# EasyEDA Pro project STM32 Minimum System.eprj

# Schematic Schematic1
Create Date: 2023-11-04; Page Name: P1; Project Name: STM32 Minimum System; Schematic Name: Schematic1; Update Date: 2023-11-03; Company: EasyEDA.com; Drawed: EasyEDA Pro; Page Size: A3; Part Number: JLCPCB-001; Reviewed: EasyEDA Pro; Version: V0.1
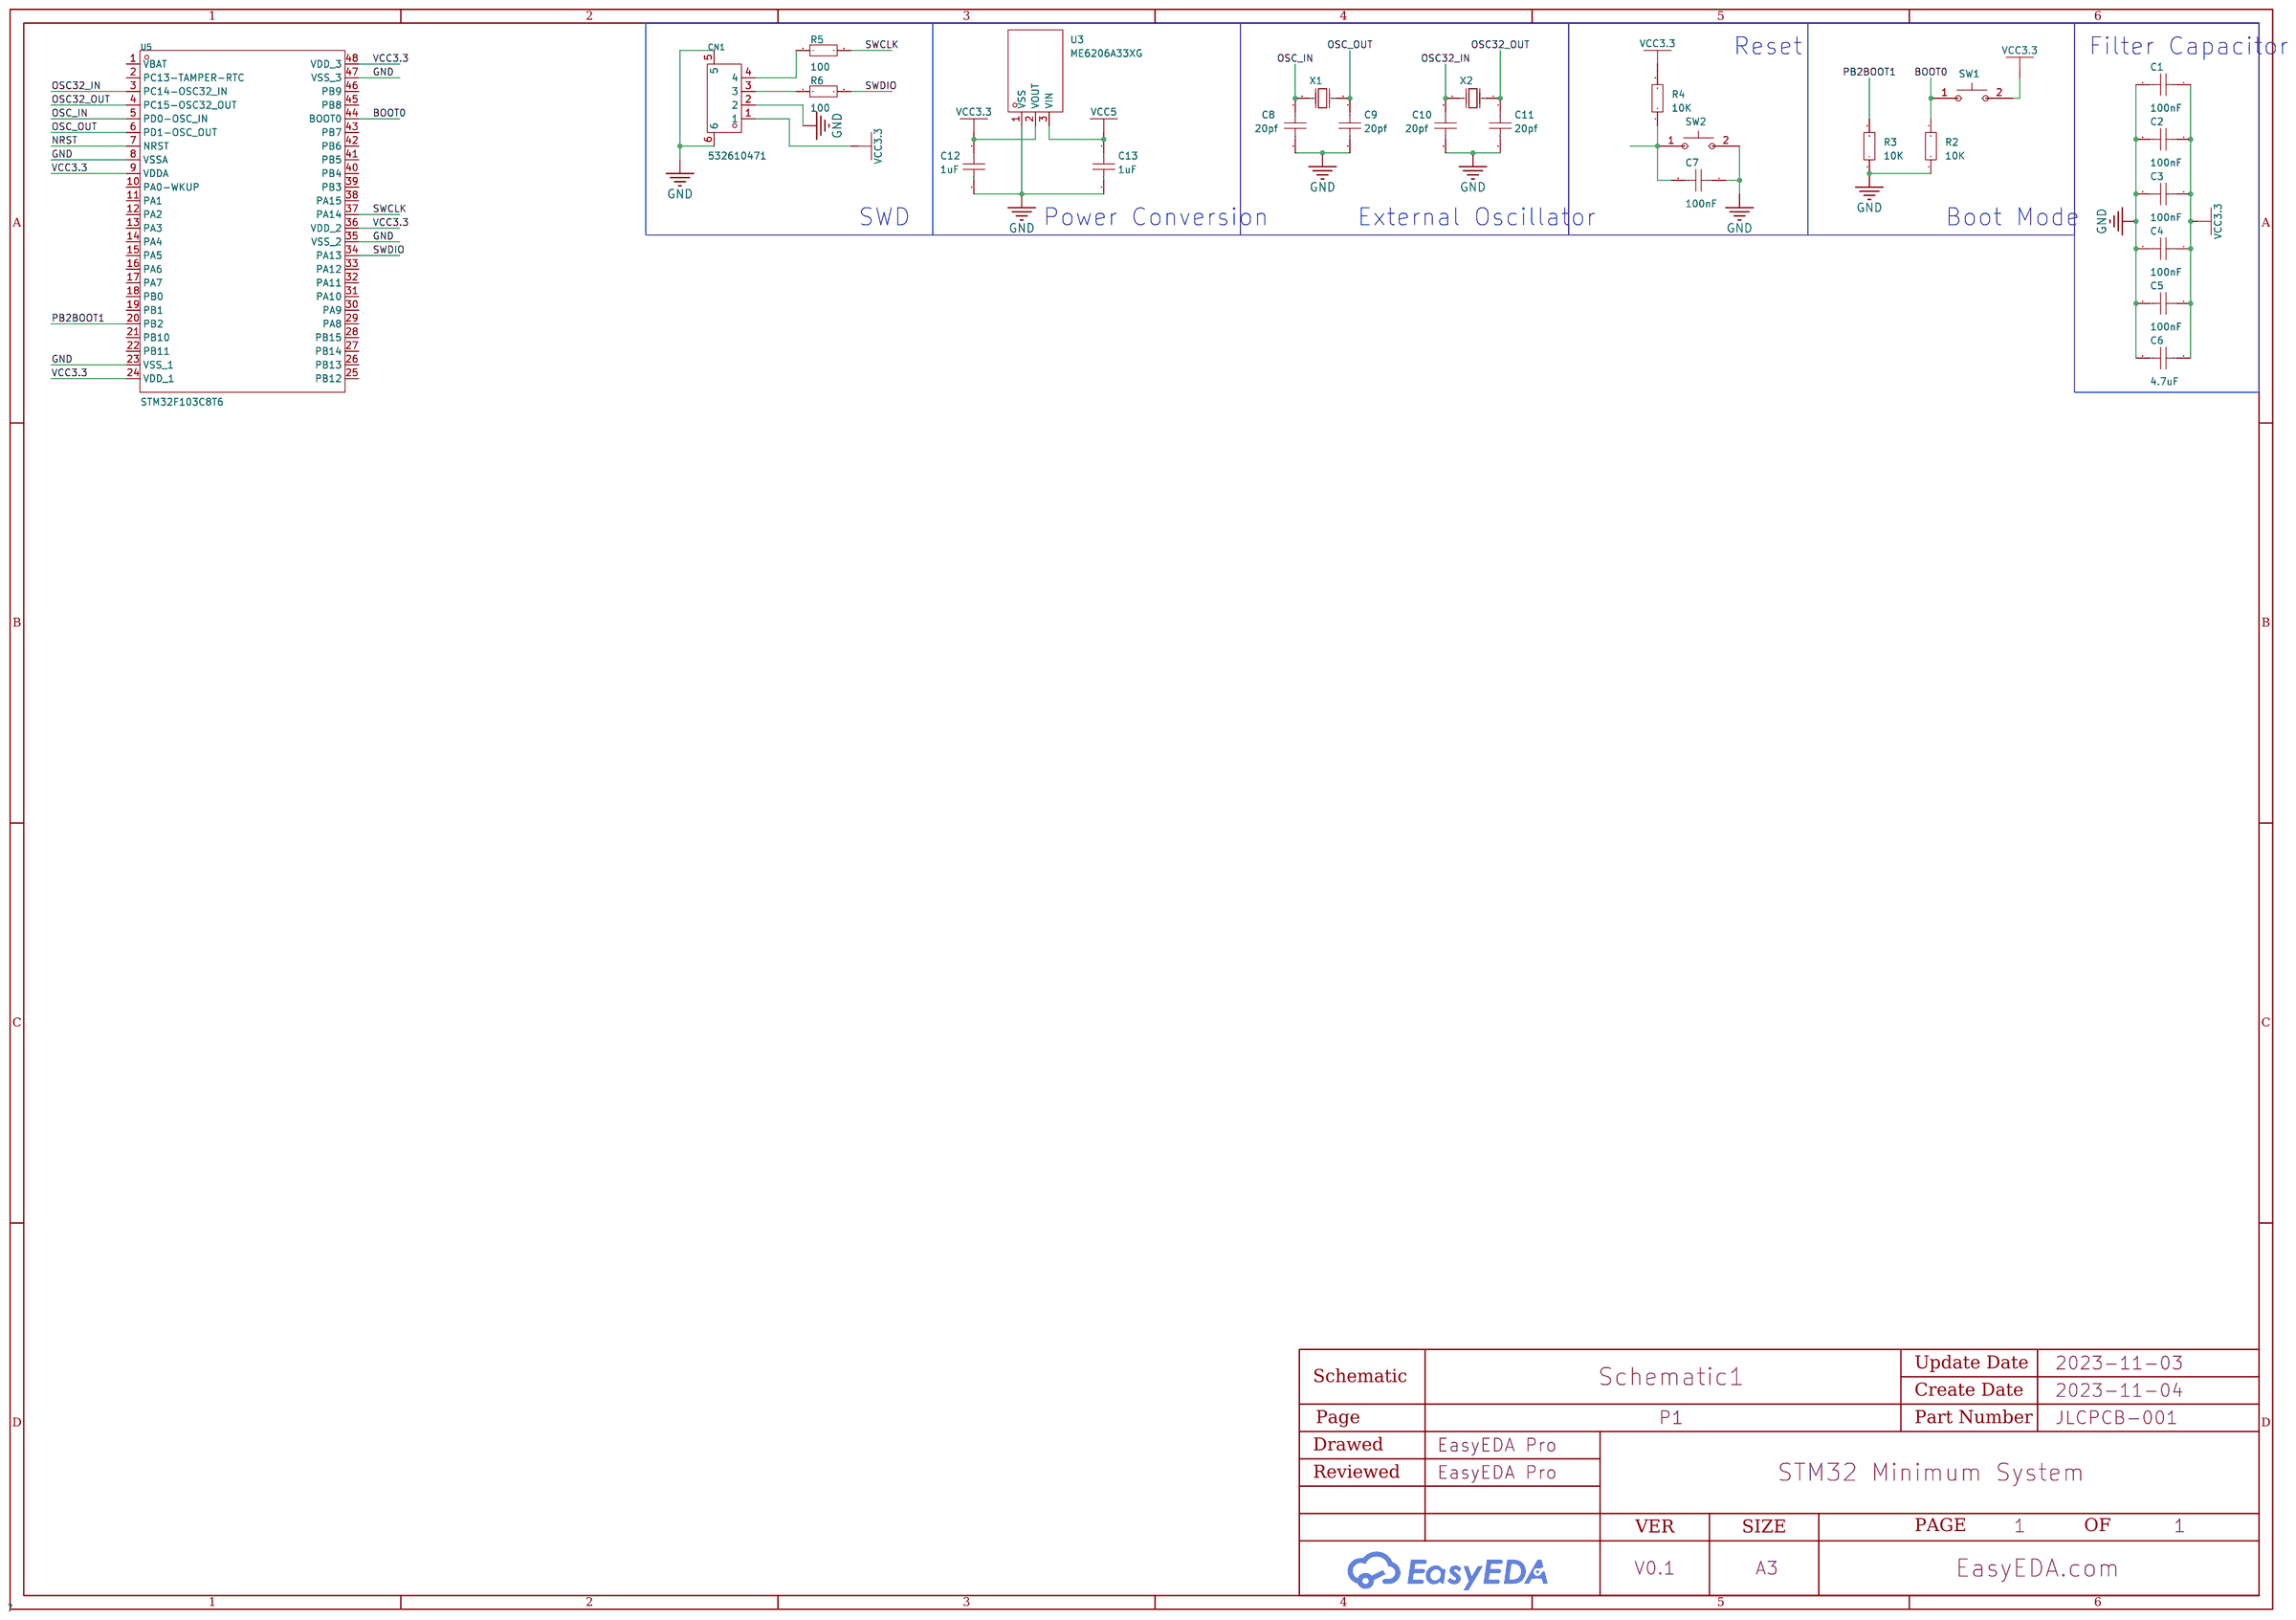
[diagram p0: schematic sheet]

## Parts
C1  100nF  [C0603]
C2  100nF  [C0603]
C3  100nF  [C0603]
C4  100nF  [C0603]
C5  100nF  [C0603]
C6  4.7uF  [C0603]
C7  100nF  [C0603]
C8  20pf  [C0603]
C9  20pf  [C0603]
C10  20pf  [C0603]
C11  20pf  [C0603]
C12  1uF  [C0603]
C13  1uF  [C0603]
CN1  532610471  [CONN-SMD_4P-P1.25_53261-0471]
R2  10K  [R0603]
R3  10K  [R0603]
R4  10K  [R0603]
R5  100  [R0603]
R6  100  [R0603]
SW1  1TS002C-2300-4300-CT  [SW-SMD_L6.0-W3.5-LS8.0-EH]
SW2  1TS002C-2300-4300-CT  [SW-SMD_L6.0-W3.5-LS8.0-EH]
U3  ME6206A33XG  [SOT-23-3_L2.9-W1.6-P1.90-LS2.8-BR]
U5  STM32F103C8T6  [LQFP-48_L7.0-W7.0-P0.50-LS9.0-BL]
X1  -  [HC-49US_L11.5-W4.5-P4.88]
X2  -  [OSC-TH_BD2.0-P0.70-D0.3]

## Library data of the parts
C1-C13 = CAP_0603: Supplier Footprint: 0603
CN1 = 532610471: Reference Series:- Pitch:1.25mm Pins Structure:1x4P Number of Rows:1 Number of PINs Per Row:4 Row Spacing:- Mounting Style:- Contact Material:bronze; LCSC Part Name: 间距:1.25mm 1x4P; Supplier Part: C240847; Manufacturer: MOLEX; Supplier Footprint: SMD,P=1.25mm; JLCPCB Part Class: Extended Part; Datasheet: https://atta.szlcsc.com/upload/public/pdf/source/20180801/C240848_05185111BCEC053393D7785380F62CFD.pdf; Supplier: LCSC; Pitch: 1.25mm; Pins Structure: 1x4P; Number of Rows: 1; Number of PINs Per Row: 4; Contact Material: bronze
R2-R6 = Res_0603: Supplier Footprint: 0603
SW1 SW2 = 1TS002C-2300-4300-CT: Contact Current:50mA Voltage Rating (DC):12V Power Rating:0.6W Insulation Resistance:100MΩ Circuit:SPST Mounting Style:Brick nogging Actuator Style:Rectangle button Actuator/Cap Color:White With Lamp:No Operating Force:230gf@±50gf Mechanical Life:30000次 O; LCSC Part Name: 6*3.5*4.3mm 立贴 轻触开关; Supplier Part: C319340; Manufacturer: HYP(鸿源精密); Supplier Footprint: SMD,3.5x6mm; JLCPCB Part Class: Extended Part; Datasheet: https://atta.szlcsc.com/upload/public/pdf/source/20181106/C319340_6D4557880F4EAE8D4DD4D90C9114405F.pdf; Supplier: LCSC; Contact Current: 50mA; Voltage Rating (DC): 12V; Power Rating: 0.6W; Insulation Resistance: 100MΩ; Circuit: SPST; Mounting Style: Brick nogging; Actuator Style: Rectangle button; Actuator/Cap Color: White; With Lamp: No; Operating Force: 230gf@±50gf; Mechanical Life: 30000次; Operating Temperature: -40℃~+90℃; Pin Style: Gull Wing; Switch Length: 6mm; Switch Width: 3.5mm; Switch Height: 4.3mm; Strike Gundam: NO
U3 = ME6206A33XG: Output Type: Output Polarity:Positive Number of Outputs:1 Maximum Input Voltage:6V Output Voltage:3.3V~3.3V Output Voltage:3.3V~3.3V Dropout Voltage:400mV@(200mA) Output Current:300mA Power Supply Rejection Ratio (PSRR):50dB@(1kHz); LCSC Part Name: 输入6V 输出3.3V 300mA; Supplier Part: C161345; Manufacturer: MICRONE(南京微盟); Supplier Footprint: SOT-23; JLCPCB Part Class: Extended Part; Datasheet: https://atta.szlcsc.com/upload/public/pdf/source/20180207/C161345_15179949863651359188.pdf; Supplier: LCSC; Output Polarity: Positive; Number of Outputs: 1; Maximum Input Voltage: 6V; Output Voltage: 3.3V~3.3V; Dropout Voltage: 400mV@(200mA); Output Current: 300mA; Power Supply Rejection Ratio (PSRR): 50dB@(1kHz)
U5 = STM32F103C8T6: CPU Core:ARM Cortex-M3 CPU Maximum Speed:72MHz Operating Voltage Range:2V~3.6V Operating Voltage Range:2V~3.6V Program Storage Size:64KB Program Memory Type:FLASH RAM Size:20KB EEPROM:- GPIO Ports Number:37 ADC (Bit):12bit DAC (Bit):- PWM (Bit):- Universa; LCSC Part Name: STM32F103C8T6 MSL=3; Supplier Part: C8734; Manufacturer: ST(意法半导体); Supplier Footprint: LQFP-48(7x7); JLCPCB Part Class: Basic Part; Datasheet: https://atta.szlcsc.com/upload/public/pdf/source/20220812/8363ACEC51AD55ECEB84799464F7CB85.pdf; Supplier: LCSC; CPU Core: ARM Cortex-M3; CPU Maximum Speed: 72MHz; Operating Voltage Range: 2V~3.6V; Program Storage Size: 64KB; Program Memory Type: FLASH; RAM Size: 20KB; GPIO Ports Number: 37; ADC (Bit): 12bit; Universal Serial Bus: 有; Peripheral/Function: WDT；DMA；WDT；On-chip temperature sensor; Watchdog: 有; Infrared Data Association: 有; Low-Voltage Detect: 有; Direct Memory Access: 有; Internal Oscillator: 有; Operating Temperature Range: -40℃~+85℃
X1 = 9B08000368: Crystal Type:- Frequency:- Load Capacitance:- Operating Temperature:- Operating Temperature:-; LCSC Part Name: DIP  HC-49S 8M 20pF 30ppm 80R -10~60℃; Supplier Part: C93660; Manufacturer: TXC(晶技); Supplier Footprint: HC-49S; JLCPCB Part Class: Extended Part; Datasheet: https://atta.szlcsc.com/upload/public/pdf/source/20170116/1484561276446.pdf; Supplier: LCSC
X2 = DT-26 32.768KHz: Crystal Type:- Frequency:- Load Capacitance:- Operating Temperature:- Operating Temperature:-; LCSC Part Name: 32.768KHz 12.5PF 20ppm; Supplier Part: C93229; Manufacturer: KDS(大真空); Supplier Footprint: DT-26; JLCPCB Part Class: Extended Part; Datasheet: https://atta.szlcsc.com/upload/public/pdf/source/20170103/1483440003252.pdf; Supplier: LCSC

## Nets
GND: C1.2 C2.2 C3.2 C4.2 C5.2 C6.2 C7.1 C8.2 C9.2 C10.2 C11.2 C12.2 C13.2 CN1.2 CN1.5 CN1.6 R2.1 R3.1 SW2.2(B) U3.1(VSS) U5.8(VSSA) U5.23(VSS_1) U5.35(VSS_2) U5.47(VSS_3)
VCC3.3: C1.1 C2.1 C3.1 C4.1 C5.1 C6.1 C12.1 CN1.1 R4.2 SW1.2(B) U3.2(VOUT) U5.9(VDDA) U5.24(VDD_1) U5.36(VDD_2) U5.48(VDD_3)
VCC5: C13.1 U3.3(VIN)
BOOT0: R2.2 SW1.1(A) U5.44(BOOT0)
NRST: U5.7(NRST)
OSC32_IN: C10.1 U5.3(PC14-OSC32_IN) X2.2(OSC2)
OSC32_OUT: C11.1 U5.4(PC15-OSC32_OUT) X2.1(OSC1)
OSC_IN: C8.1 U5.5(PD0-OSC_IN) X1.1(OSC1)
OSC_OUT: C9.1 U5.6(PD1-OSC_OUT) X1.2(OSC2)
PB2BOOT1: R3.2 U5.20(PB2)
SWCLK: R5.2 U5.37(PA14)
SWDIO: R6.2 U5.34(PA13)
Net-(C7-2): C7.2 R4.1 SW2.1(A)
Net-(CN1-3): CN1.3 R6.1
Net-(CN1-4): CN1.4 R5.1

Not connected (* = marked no-connect by the designer): U5 1(VBAT) 2(PC13-TAMPER-RTC) 10(PA0-WKUP) 11(PA1) 12(PA2) 13(PA3) 14(PA4) 15(PA5) 16(PA6) 17(PA7) 18(PB0) 19(PB1) 21(PB10) 22(PB11) 25(PB12) 26(PB13) 27(PB14) 28(PB15) 29(PA8) 30(PA9) 31(PA10) 32(PA11) 33(PA12) 38(PA15) 39(PB3) 40(PB4) 41(PB5) 42(PB6) 43(PB7) 45(PB8) 46(PB9)

## Notes on the sheet
- Reset
- Filter Capacitor
- SWD
- Power Conversion
- External Oscillator
- Boot Mode
